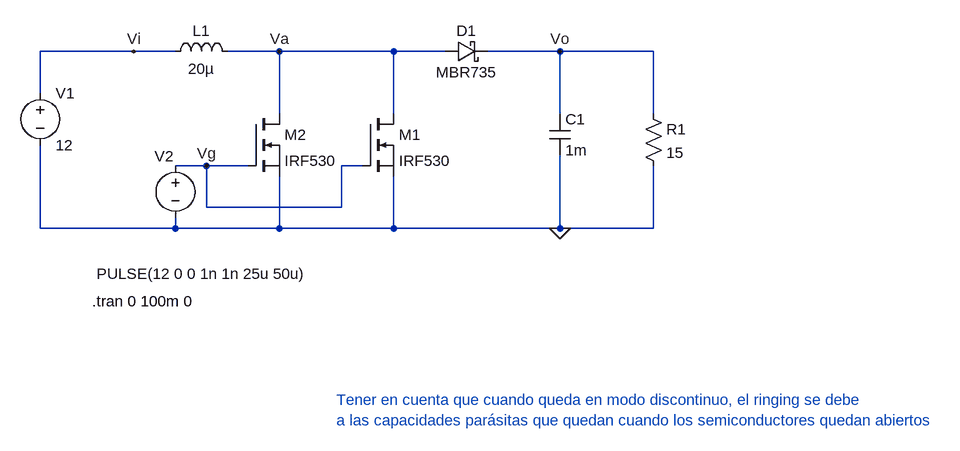
[diagram p0: schematic Regulador_boost.asc]
Regulador_boost.asc, the LTspice schematic file:
Version 4
SHEET 1 1644 680
WIRE 176 48 32 48
WIRE 240 48 176 48
WIRE 400 48 320 48
WIRE 576 48 400 48
WIRE 656 48 576 48
WIRE 832 48 720 48
WIRE 976 48 832 48
WIRE 32 112 32 48
WIRE 400 144 400 48
WIRE 576 144 576 48
WIRE 832 144 832 48
WIRE 976 144 976 48
WIRE 288 224 240 224
WIRE 352 224 288 224
WIRE 528 224 496 224
WIRE 288 288 288 224
WIRE 496 288 496 224
WIRE 496 288 288 288
WIRE 32 320 32 192
WIRE 240 320 240 304
WIRE 240 320 32 320
WIRE 400 320 400 240
WIRE 400 320 240 320
WIRE 576 320 576 240
WIRE 576 320 400 320
WIRE 832 320 832 208
WIRE 832 320 576 320
WIRE 976 320 976 224
WIRE 976 320 832 320
FLAG 832 320 0
FLAG 832 48 Vo
FLAG 176 48 Vi
FLAG 400 48 Va
FLAG 288 224 Vg
SYMBOL voltage 32 96 R0
WINDOW 123 0 0 Left 0
WINDOW 39 0 0 Left 0
SYMATTR InstName V1
SYMATTR Value 12
SYMBOL voltage 240 208 R0
WINDOW 3 -121 182 Left 2
WINDOW 123 0 0 Left 0
WINDOW 39 0 0 Left 0
WINDOW 0 -32 1 Left 2
SYMATTR Value PULSE(12 0 0 1n 1n 25u 50u)
SYMATTR InstName V2
SYMBOL schottky 656 32 M90
WINDOW 0 0 32 VBottom 2
WINDOW 3 32 32 VTop 2
SYMATTR InstName D1
SYMATTR Value MBR735
SYMATTR Description Diode
SYMATTR Type diode
SYMBOL ind 224 64 R270
WINDOW 0 32 56 VTop 2
WINDOW 3 5 56 VBottom 2
SYMATTR InstName L1
SYMATTR Value 20µ
SYMBOL cap 816 144 R0
SYMATTR InstName C1
SYMATTR Value 1m
SYMBOL res 960 128 R0
SYMATTR InstName R1
SYMATTR Value 15
SYMBOL nmos 352 144 R0
SYMATTR InstName M2
SYMATTR Value IRF530
SYMBOL nmos 528 144 R0
SYMATTR InstName M1
SYMATTR Value IRF530
TEXT 112 432 Left 2 !.tran 0 100m 0
TEXT 488 584 Left 2 ;Tener en cuenta que cuando queda en modo discontinuo, el ringing se debe\na las capacidades parásitas que quedan cuando los semiconductores quedan abiertos

The netlist it stands for:
* Regulador_boost.asc
V1 Vi 0 12
V2 Vg 0 PULSE(12 0 0 1n 1n 25u 50u)
D1 Va Vo MBR735
L1 Vi Va 20µ
C1 Vo 0 1m
R1 Vo 0 15
M2 Va Vg 0 0 IRF530
M1 Va Vg 0 0 IRF530
.model D D
.lib standard.dio
.model NMOS NMOS
.model PMOS PMOS
.lib standard.mos
.tran 0 100m 0
* Tener en cuenta que cuando queda en modo discontinuo, el ringing se debe
* a las capacidades parásitas que quedan cuando los semiconductores quedan abiertos
.backanno
.end